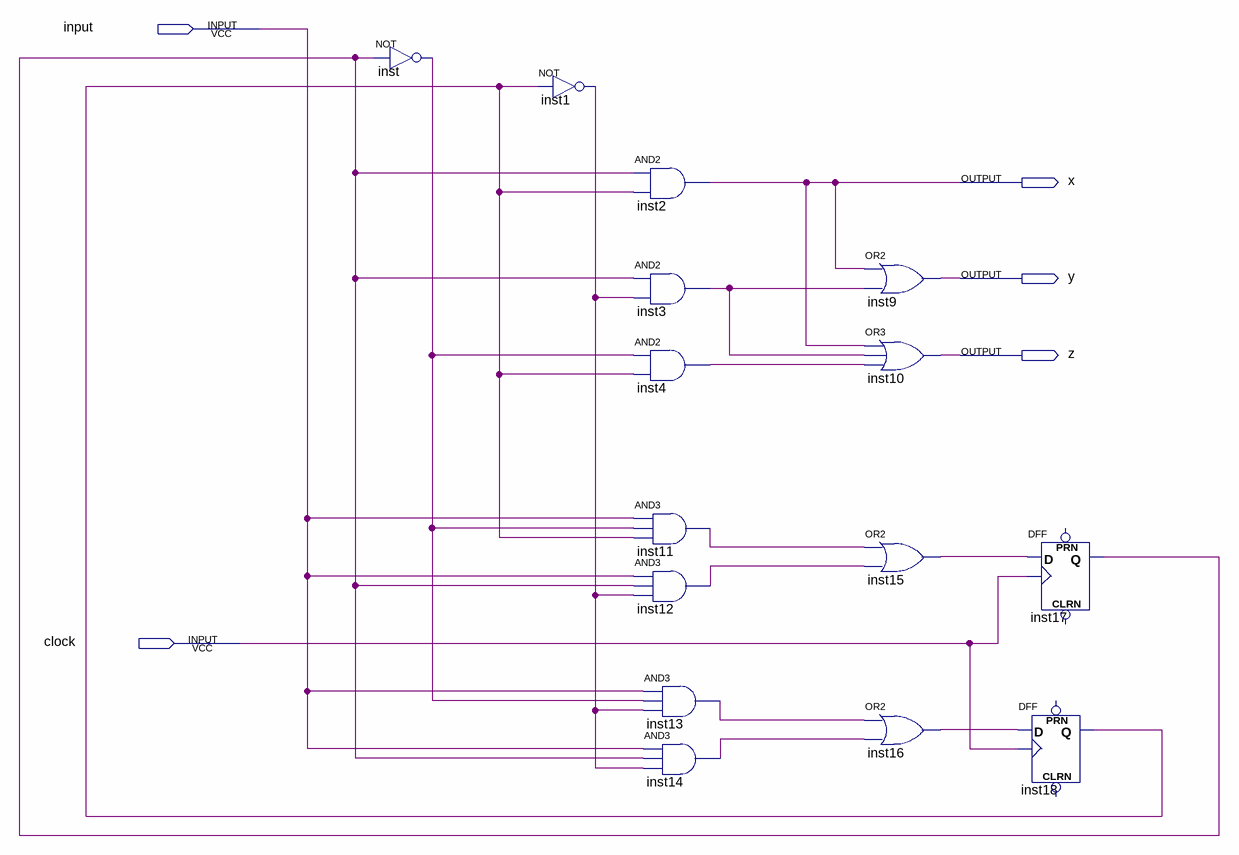
[diagram p0: schematic sheet]
// Quartus schematic danger_light.bdf as structural Verilog: 15 symbols, 5 pins
module danger_light (
  input  \input ,
  input  clock,
  output x,
  output y,
  output z
);

  wire inst1_out, inst3_out, inst4_out, inst11_out, inst12_out, inst13_out, inst14_out, inst15_out,
       inst16_out, inst17_q, inst18_q, inst_out;

  not inst (inst_out, inst17_q);
  not inst1 (inst1_out, inst18_q);
  and inst2 (x, inst17_q, inst18_q);
  and inst3 (inst3_out, inst17_q, inst1_out);
  and inst4 (inst4_out, inst_out, inst18_q);
  and inst11 (inst11_out, \input , inst_out, inst18_q);
  and inst12 (inst12_out, \input , inst17_q, inst1_out);
  and inst13 (inst13_out, \input , inst_out, inst1_out);
  and inst14 (inst14_out, \input , inst17_q, inst1_out);
  or inst9 (y, x, inst3_out);
  or inst10 (z, x, inst3_out, inst4_out);
  or inst15 (inst15_out, inst11_out, inst12_out);
  or inst16 (inst16_out, inst13_out, inst14_out);
  DFF inst18 (.CLK(clock), .D(inst16_out), .Q(inst18_q));  // open: CLRN, PRN
  DFF inst17 (.CLK(clock), .D(inst15_out), .Q(inst17_q));  // open: CLRN, PRN
endmodule
